# EasyEDA Pro project ProPrj_智能车驱动板2_2025-03-05.epro

# Schematic Schematic1
Board Name: Board1; Create Date: 2025-01-11; Page Name: P1; Project Name: 智能车驱动板1; Schematic Name: Schematic1; Update Date: 2025-02-16; Company: 嘉立创EDA; Page Size: A4; Version: V1.0
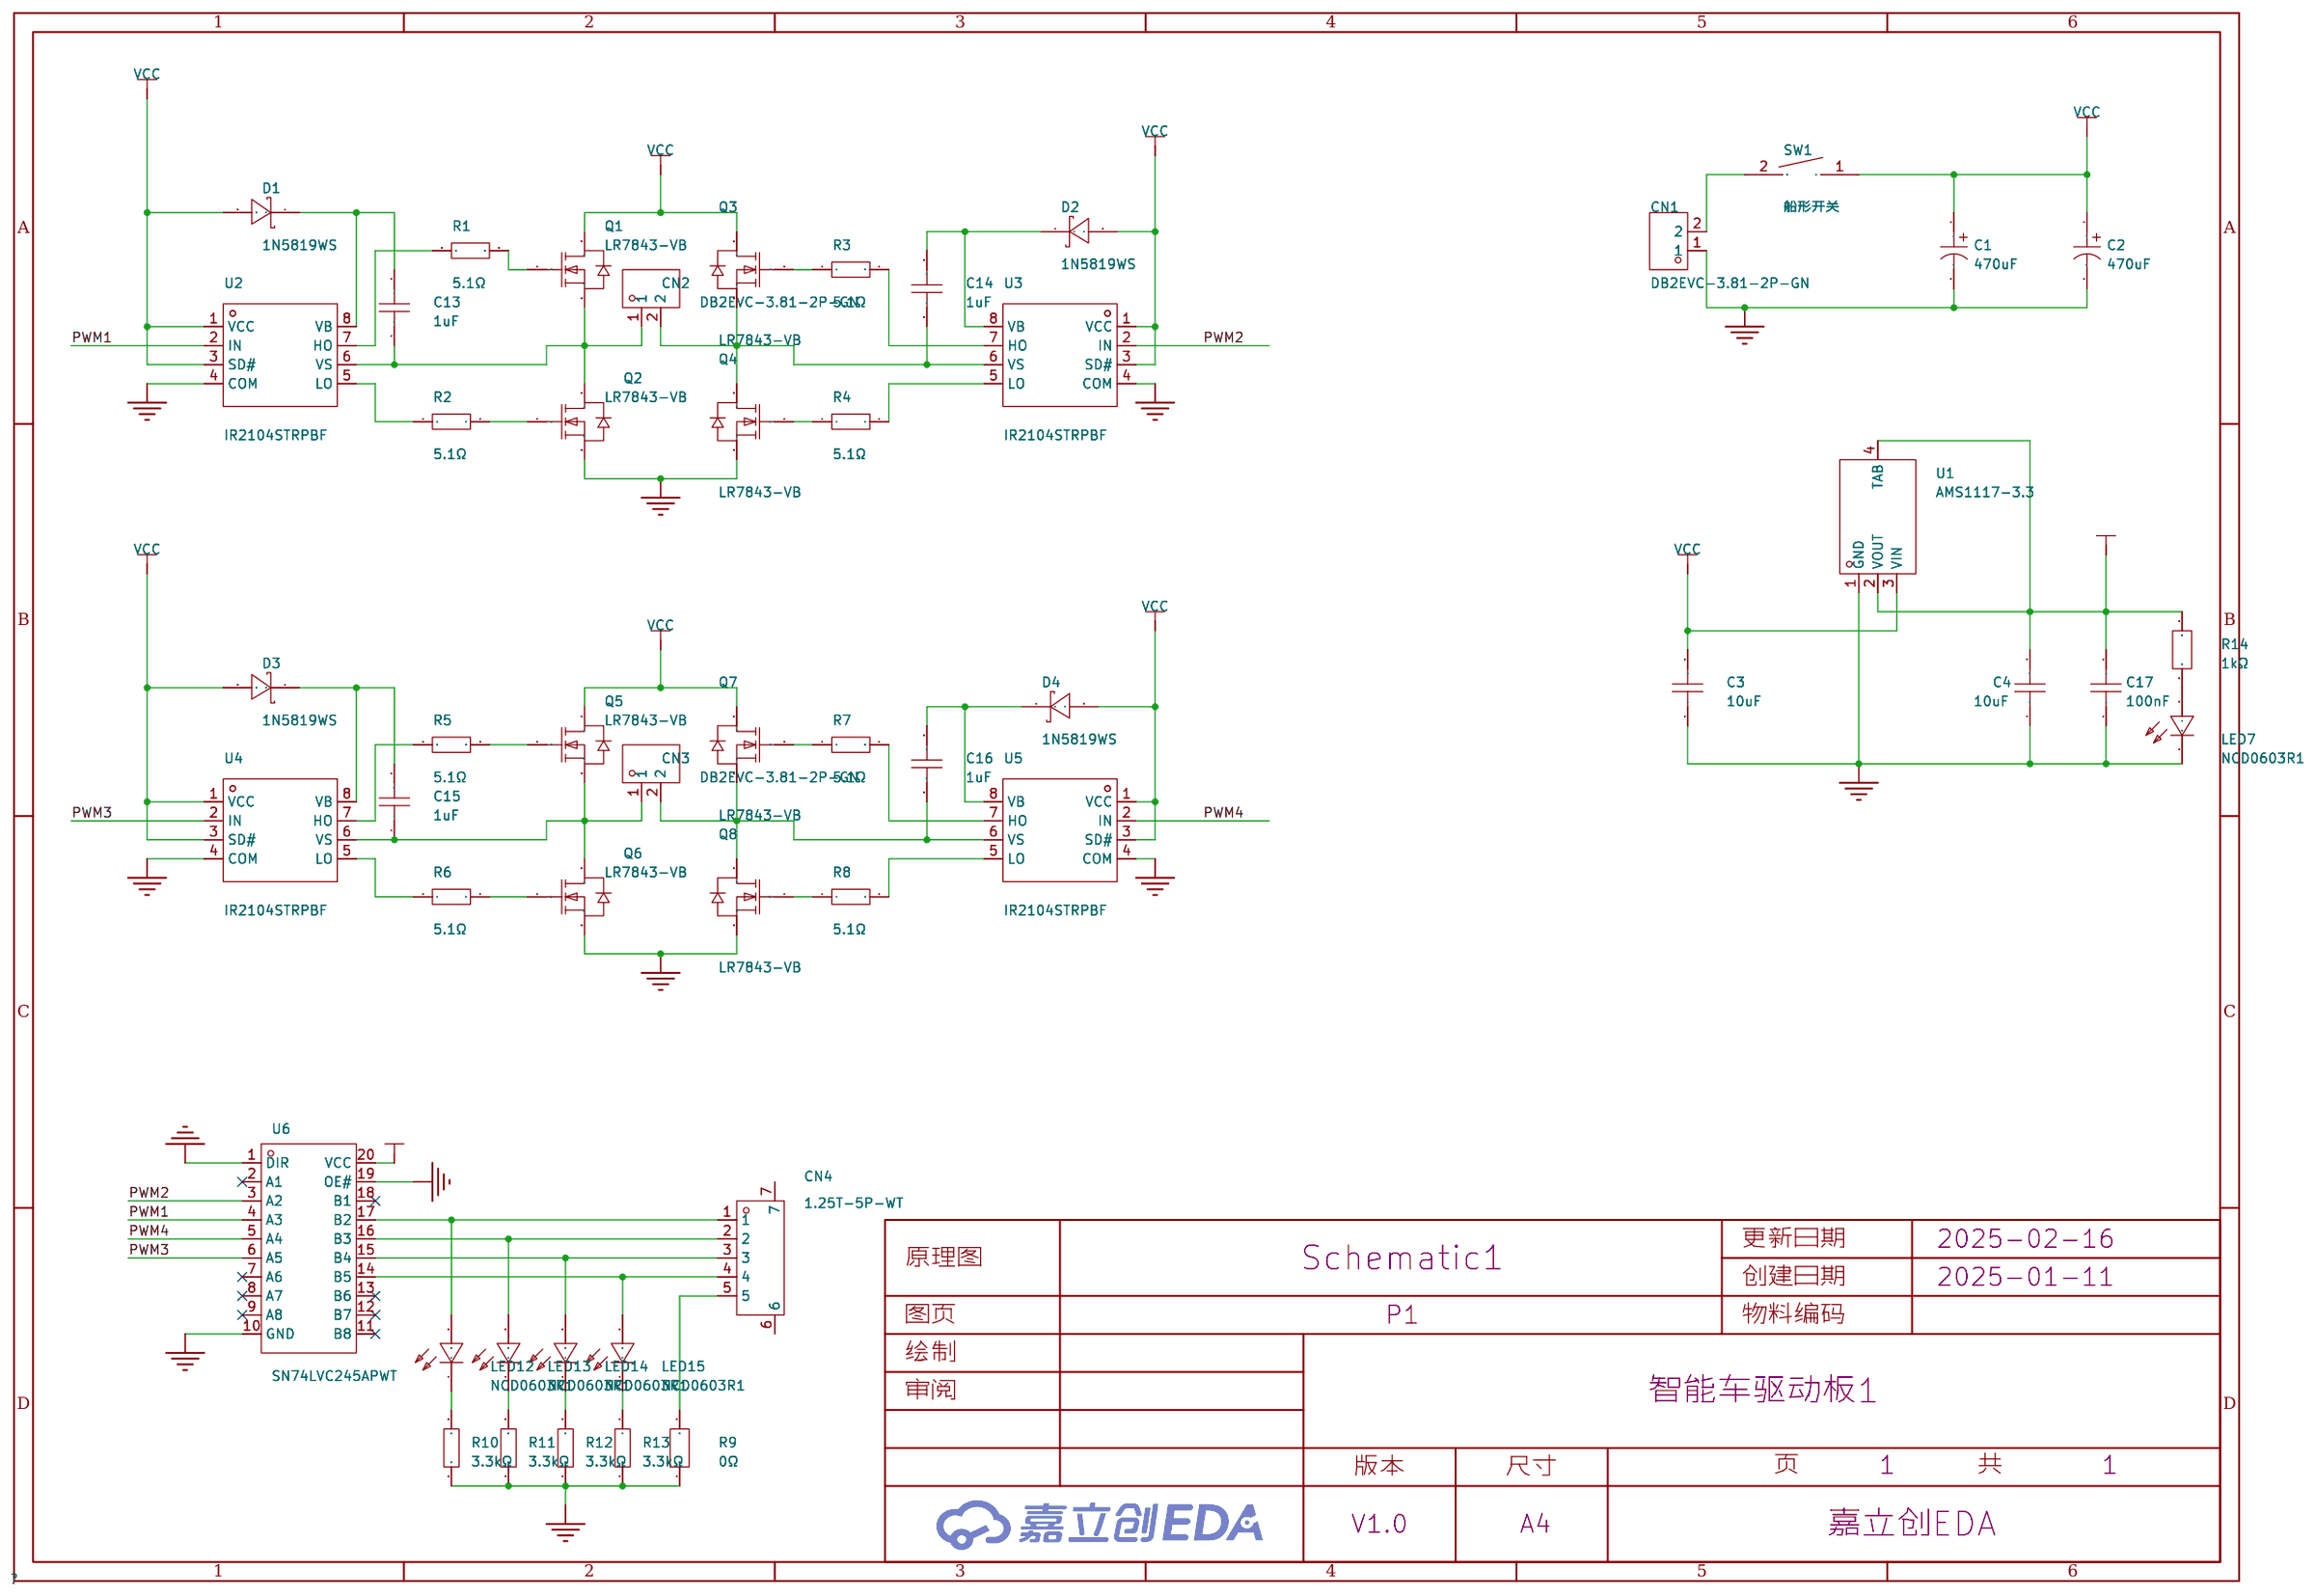
[diagram p0: schematic sheet]

## Parts
C1  470uF  [CAP-SMD_BD6.3-L6.6-W6.6-LS7.2-FD]
C2  470uF  [CAP-SMD_BD6.3-L6.6-W6.6-LS7.2-FD]
C3  10uF  [C0603]
C4  10uF  [C0603]
C13  1uF  [C0603]
C14  1uF  [C0603]
C15  1uF  [C0603]
C16  1uF  [C0603]
C17  100nF  [C0805]
CN1  DB2EVC-3.81-2P-GN  [CONN-TH_2P-P3.81_DB2EVC-3.81-2P-BK]
CN2  DB2EVC-3.81-2P-GN  [CONN-TH_2P-P3.81_DB2EVC-3.81-2P-BK]
CN3  DB2EVC-3.81-2P-GN  [CONN-TH_2P-P3.81_DB2EVC-3.81-2P-BK]
CN4  1.25T-5P-WT  [CONN-SMD_5P-P1.25_1.25T-5P-WT]
D1  1N5819WS  [SOD-323_L1.8-W1.3-LS2.5-RD]
D2  1N5819WS  [SOD-323_L1.8-W1.3-LS2.5-RD]
D3  1N5819WS  [SOD-323_L1.8-W1.3-LS2.5-RD]
D4  1N5819WS  [SOD-323_L1.8-W1.3-LS2.5-RD]
LED7  NCD0603R1  [LED0603-RD_RED]
LED12  NCD0603R1  [LED0603-RD_RED]
LED13  NCD0603R1  [LED0603-RD_RED]
LED14  NCD0603R1  [LED0603-RD_RED]
LED15  NCD0603R1  [LED0603-RD_RED]
Q1  LR7843-VB  [TO-252-2_L6.6-W6.1-P4.58-LS9.9-BR]
Q2  LR7843-VB  [TO-252-2_L6.6-W6.1-P4.58-LS9.9-BR]
Q3  LR7843-VB  [TO-252-2_L6.6-W6.1-P4.58-LS9.9-BR]
Q4  LR7843-VB  [TO-252-2_L6.6-W6.1-P4.58-LS9.9-BR]
Q5  LR7843-VB  [TO-252-2_L6.6-W6.1-P4.58-LS9.9-BR]
Q6  LR7843-VB  [TO-252-2_L6.6-W6.1-P4.58-LS9.9-BR]
Q7  LR7843-VB  [TO-252-2_L6.6-W6.1-P4.58-LS9.9-BR]
Q8  LR7843-VB  [TO-252-2_L6.6-W6.1-P4.58-LS9.9-BR]
R1  5.1Ω  [R0805]
R2  5.1Ω  [R0805]
R3  5.1Ω  [R0805]
R4  5.1Ω  [R0805]
R5  5.1Ω  [R0805]
R6  5.1Ω  [R0805]
R7  5.1Ω  [R0805]
R8  5.1Ω  [R0805]
R9  0Ω  [R0603]
R10  3.3kΩ  [R0603]
R11  3.3kΩ  [R0603]
R12  3.3kΩ  [R0603]
R13  3.3kΩ  [R0603]
R14  1kΩ  [R0603]
SW1  船形开关  [SW-TH_RS601HL-1010011BB]
U1  AMS1117-3.3  [SOT-223-3_L6.5-W3.5-P3.05-LS7.0]
U2  IR2104STRPBF  [SOIC-8_L4.9-W3.9-P1.27-LS6.0-BL]
U3  IR2104STRPBF  [SOIC-8_L4.9-W3.9-P1.27-LS6.0-BL]
U4  IR2104STRPBF  [SOIC-8_L4.9-W3.9-P1.27-LS6.0-BL]
U5  IR2104STRPBF  [SOIC-8_L4.9-W3.9-P1.27-LS6.0-BL]
U6  SN74LVC245APWT  [TSSOP-20_L6.5-W4.4-P0.65-LS6.4-BL]

## Library data of the parts
C1 C2 = PM101M025E077PTR: 容值:100uF;精度:±20%;额定电压:25V;; LCSC Part Name: 100uF ±20% 25V; Supplier Part: C2858382; Manufacturer: CapXon(丰宾); Supplier Footprint: SMD,6.3x7.7mm; JLCPCB Part Class: 扩展库; Datasheet: https://atta.szlcsc.com/upload/public/pdf/source/20210804/C2858382_57ECED37ED638FF3D71FBD68EF7F0C39.pdf; Supplier: LCSC; Tolerance: ±20%; Rated Voltage: 25V
C3 C4 = CGA0603X5R106K100JT: 容值:10uF;精度:±10%;额定电压:10V;材质(温度系数):X5R;; LCSC Part Name: 10uF ±10% 10V; Supplier Part: C6119842; Manufacturer: HRE(芯声); Supplier Footprint: 0603; JLCPCB Part Class: 扩展库; Supplier: LCSC; Tolerance: ±10%; Voltage Rated: 10V; Temperature Coefficient: X5R
C13-C16 = CGA0603X5R105K160JT: 容值:1uF;精度:±10%;额定电压:16V;材质(温度系数):X5R;; LCSC Part Name: 1uF ±10% 16V; Supplier Part: C6119849; Manufacturer: HRE(芯声); Supplier Footprint: 0603; JLCPCB Part Class: 扩展库; Supplier: LCSC; Tolerance: ±10%; Voltage Rated: 16V; Temperature Coefficient: X5R
C17 = CC0805KRX7R9BB104: 容值:100nF;精度:±10%;额定电压:50V;材质(温度系数):X7R;; LCSC Part Name: 100nF ±10% 50V; Supplier Part: C49678; Manufacturer: YAGEO(国巨); Supplier Footprint: 0805; JLCPCB Part Class: 基础库; Datasheet: https://atta.szlcsc.com/upload/public/pdf/source/20180224/C181747_15194369449651363981.pdf; Supplier: LCSC; Tolerance: ±10%; Voltage Rated: 50V; Temperature Coefficient: X7R
CN1-CN3 = DB2EVC-3.81-2P-GN: 连接器类型:板端/插座-闭口;结构:1x2P;间距:3.81mm;颜色:绿色;安装方式:直针;排数:1;每排PIN数:2;额定电流:10A;额定电压:250V;工作温度范围:-40℃~+105℃;; LCSC Part Name: 3.81mm 1x2P 排数:1 每排P数:2; Supplier Part: C395686; Manufacturer: DORABO(地博电气); Supplier Footprint: 插件,P=3.81mm; JLCPCB Part Class: 扩展库; Datasheet: https://atta.szlcsc.com/upload/public/pdf/source/20230106/E295F87ABDAA44E449E4D4A582259339.pdf; Supplier: LCSC; Connector Type: 板端/插座-闭口; Structure: 1x2P; Pitch: 3.81mm; Color: 绿色; Mounting Style: 直针; Number of Pins: 2P; Number of Rows: 1; Number of PINs Per Row: 2; Current Rating (Max): 10A; Voltage Rating (Max): 250V; Operating Temperature Range: -40℃~+105℃
CN4 = 1.25T-5P-WT: 插针结构:1x5P;间距:1.25mm;安装方式:-;参考系列:-;总PIN数:5P;排数:1;每排PIN数:5;行距:-;触头材质:磷青铜;; LCSC Part Name: 1x5P 间距:1.25mm; Supplier Part: C97378; Manufacturer: 韩国韩荣; Supplier Footprint: SMD,P=1.25mm; JLCPCB Part Class: 扩展库; Datasheet: https://atta.szlcsc.com/upload/public/pdf/source/20200721/C707315_EB981FF53C07D03444DA83DA11F0005F.pdf; Supplier: LCSC; Pins Structure: 1x5P; Pitch: 1.25mm; Number of Pins: 5P; Number of Rows: 1; Number of PINs Per Row: 5; Contact Material: 磷青铜
D1-D4 = 1N5819WS_C191023: 正向压降(Vf):600mV@1A;直流反向耐压(Vr):40V;整流电流:1A;; LCSC Part Name: 电压:40V 电流:1A; Supplier Part: C191023; Manufacturer: Hottech(合科泰); Supplier Footprint: SOD-323; JLCPCB Part Class: 基础库; Datasheet: https://atta.szlcsc.com/upload/public/pdf/source/20220428/3CB86FD8D28D653594B4E35F9D5AEFD9.pdf; Supplier: LCSC; Forward Voltage (Vf@If): 600mV@1A; Reverse Voltage (Vr): 40V; Rectified Current: 1A
LED7 LED12-LED15 = NCD0603R1_C84263: 灯头类型:-;发光颜色:红色;正向电压(VF):1.6V~2.6V;功率:65mW;正向电流:20mA;主波长:615nm~630nm;二极管配置:独立二极管;透镜颜色:无色透明透镜;色温:-;发光强度:80mcd~220mcd;发光角度:130°;载带方式:-;工作温度:-30℃~+85℃;; Supplier Part: C84263; Manufacturer: 国星光电; Supplier Footprint: 0603; JLCPCB Part Class: 扩展库; Datasheet: https://atta.szlcsc.com/upload/public/pdf/source/20200820/C84263_DABC6A75E58F576973B407FDBA283D60.pdf; Supplier: LCSC; Emitted Color: 红色; Forward Voltage (VF): 1.6V~2.6V; Power Dissipation: 65mW; Forward Current: 20mA; Dominant Wavelength: 615nm~630nm; Diode Configuration: 独立二极管; Lens Color: 无色透明透镜; Luminous Intensity: 80mcd~220mcd; Viewing Angle: 130°; Operating Temperature: -30℃~+85℃
Q1-Q8 = LR7843-VB: 类型:1个N沟道;漏源电压(Vdss):30V;连续漏极电流(Id):35.8A;导通电阻(RDS(on)@Vgs,Id):2.3mΩ@10V,38.8A;功率(Pd):3.75W;阈值电压(Vgs(th)@Id):1.5V@250uA;; LCSC Part Name: 1个N沟道 耐压:30V 电流:120A; Supplier Part: C5137375; Manufacturer: VBsemi(微碧半导体); Supplier Footprint: TO-252; JLCPCB Part Class: 扩展库; Datasheet: https://atta.szlcsc.com/upload/public/pdf/source/20240814/AEBBAF20133735F24F8E0E251780DEE5.pdf; Supplier: LCSC; Type: 1个N沟道; Drain Source Voltage (Vdss): 30V; Continuous Drain Current (Id): 35.8A; Drain Source On Resistance (RDS(on)@Vgs,Id): 2.3mΩ@10V,38.8A; Power Dissipation (Pd): 3.75W; Gate Threshold Voltage (Vgs(th)@Id): 1.5V@250uA; Total Gate Charge (Qg@Vgs): 81.5nC@10V; Input Capacitance (Ciss@Vds): 6.201nF@15V; Reverse Transfer Capacitance (Crss@Vds): 970pF@15V; Operating Temperature: -55℃~+175℃
R1-R8 = 0805W8F510KT5E: 电阻类型:厚膜电阻;阻值:5.1Ω;精度:±1%;功率:125mW;最大工作电压:150V;温度系数:±400ppm/℃;; LCSC Part Name: 5.1Ω ±1% 125mW 厚膜电阻; Supplier Part: C17724; Manufacturer: UNI-ROYAL(厚声); Supplier Footprint: 0805; JLCPCB Part Class: 基础库; Datasheet: https://atta.szlcsc.com/upload/public/pdf/source/20200306/C422600_1E6D84923E4A46A82E41ADD87F860B5C.pdf; Supplier: LCSC; Type: 厚膜电阻; Tolerance: ±1%; Power(Watts): 125mW; Overload Voltage (Max): 150V; Temperature Coefficient: ±400ppm/℃; Operating Temperature Range: -55℃~+155℃
R9 = FRC0603F0000TS: 电阻类型:厚膜电阻;阻值:0Ω;精度:±1%;功率:100mW;最大工作电压:75V;; LCSC Part Name: 0Ω ±1% 100mW 厚膜电阻; Supplier Part: C2906974; Manufacturer: FOJAN(富捷); Supplier Footprint: 0603; JLCPCB Part Class: 扩展库; Datasheet: https://atta.szlcsc.com/upload/public/pdf/source/20211221/925EC7D7225764EE0046F22065062C87.pdf; Supplier: LCSC; Type: 厚膜电阻; Tolerance: ±1%; Power(Watts): 100mW; Overload Voltage (Max): 75V; Operating Temperature Range: -55℃~+155℃
R10-R13 = 0603WAF3301T5E: 电阻类型:厚膜电阻;阻值:3.3kΩ;精度:±1%;功率:100mW;最大工作电压:75V;温度系数:±100ppm/℃;; LCSC Part Name: 3.3kΩ ±1% 100mW 厚膜电阻; Supplier Part: C22978; Manufacturer: UNI-ROYAL(厚声); Supplier Footprint: 0603; JLCPCB Part Class: 基础库; Datasheet: https://atta.szlcsc.com/upload/public/pdf/source/20200306/C422600_1E6D84923E4A46A82E41ADD87F860B5C.pdf; Supplier: LCSC; Type: 厚膜电阻; Tolerance: ±1%; Power(Watts): 100mW; Overload Voltage (Max): 75V; Temperature Coefficient: ±100ppm/℃; Operating Temperature Range: -55℃~+155℃
R14 = FCR0603F1K: 电阻类型:厚膜电阻;阻值:1kΩ;精度:±1%;功率:100mW;最大工作电压:75V;; LCSC Part Name: 1K ±1%; Supplier Part: C5913168; Manufacturer: VO(翔胜); Supplier Footprint: 0603; JLCPCB Part Class: 扩展库; Datasheet: https://atta.szlcsc.com/upload/public/pdf/source/20230428/98B65D379E9BA4CF2A9223D1647B01B6.pdf; Supplier: LCSC; Type: 厚膜电阻; Tolerance: ±1%; Power(Watts): 100mW; Overload Voltage (Max): 75V; Operating Temperature Range: -55℃~+155℃
SW1 = RS601HL-1010011BB: 带灯:无;引脚样式:焊片;额定电流:3A;额定电压(AC):250V;额定电压(DC):-;电路结构:单刀单掷;机械寿命:1万次;; Supplier Part: C2885782; Manufacturer: HCTL(华灿天禄); Supplier Footprint: 插件; JLCPCB Part Class: 扩展库; Datasheet: https://atta.szlcsc.com/upload/public/pdf/source/20210820/B1970E40D09304D7FA648AE2099FB3E8.pdf; Supplier: LCSC; Switch Length: 15mm; Switch Width: 10.5mm; Switch Height: 11.7mm; Actuator Type: 凹面弯曲; With Lamp: 无; Pin Style: 焊片; Actuator Color: 黑色; Contact Current: 3A; Voltage Rating (AC): 250V; Circuit: 单刀单掷; Mechanical Life: 1万次; Operating Temperature: -25℃~+85℃; Actuator Identifier: - O
U1 = AMS1117-3.3_C5250992: 输出类型:固定;工作电压:12V;输出电压:3.3V;输出电流:1A;电源纹波抑制比(PSRR):70dB@(120Hz);输出极性:正极;; Supplier Part: C5250992; Manufacturer: TWGMC(台湾迪嘉); Supplier Footprint: SOT-223-3L; JLCPCB Part Class: 扩展库; Datasheet: https://atta.szlcsc.com/upload/public/pdf/source/20221109/A58A92B07670E85D28928AE371260E8D.pdf; Supplier: LCSC; Output Type: 固定; Maximum Input Voltage: 12V; Output Voltage: 3.3V; Output Current: 1A; Power Supply Rejection Ratio (PSRR): 70dB@(120Hz); Operating Temperature: -40℃~+125℃@(Tj); Output Polarity: 正极; Number of Outputs: 1
U2-U5 = IR2104STRPBF: 驱动配置:半桥;负载类型:MOSFET；IGBT;驱动通道数:2;峰值灌电流:360mA;峰值拉电流:210mA;电源电压:10V~20V;上升时间:100ns;下降时间:50ns;; Supplier Part: C2960; Manufacturer: Infineon(英飞凌); Supplier Footprint: SOIC-8; JLCPCB Part Class: 扩展库; Datasheet: https://atta.szlcsc.com/upload/public/pdf/source/20140906/1457707236579.pdf; Supplier: LCSC; Driven Configuration: 半桥; Load Type: MOSFET；IGBT; Number of Drivers: 2; Peak Output Current(sink): 360mA; Peak Output Current(source): 210mA; Supply Voltage: 10V~20V; Rise Time: 100ns; Fall Time: 50ns; Operating Temperature: -40℃~+150℃@(Tj)
U6 = SN74LVC245APWT: 电源电压:1.65V~3.6V;元件数:1;每个元件位数:8;灌电流(IOL):24mA;拉电流(IOH):24mA;; Supplier Part: C2675658; Manufacturer: TI(德州仪器); Supplier Footprint: TSSOP-20; JLCPCB Part Class: 扩展库; Datasheet: https://www.ti.com/cn/lit/gpn/sn74lvc245a; Supplier: LCSC; output type: 三态; Supply Voltage: 1.65V~3.6V; Number of Elements: 1; Number of Bits per Element: 8; Sink Current: 24mA; Source Current: 24mA; Logic Family: 74LVC; Operating Temperature: -40℃~+125℃

## Nets
3V3: C4.2 C17.2 R14.2 U1.2(VOUT) U1.4(TAB) U6.20(VCC)
GND: C1.2 C2.2 C3.1 C4.1 C17.1 CN1.1 LED7.1(K) Q2.3(S) Q4.3(S) Q6.3(S) Q8.3(S) R9.1 R10.1 R11.1 R12.1 R13.1 U1.1(GND) U2.4(COM) U3.4(COM) U4.4(COM) U5.4(COM) U6.1(DIR) U6.10(GND) U6.19(OE#)
VCC: C1.1 C2.1 C3.2 D1.2(A) D2.2(A) D3.2(A) D4.2(A) Q1.2(D) Q3.2(D) Q5.2(D) Q7.2(D) SW1.1 U1.3(VIN) U2.1(VCC) U2.3(SD#) U3.1(VCC) U3.3(SD#) U4.1(VCC) U4.3(SD#) U5.1(VCC) U5.3(SD#)
PWM1: U2.2(IN) U6.4(A3)
PWM2: U3.2(IN) U6.3(A2)
PWM3: U4.2(IN) U6.6(A5)
PWM4: U5.2(IN) U6.5(A4)
$1N392: CN1.2 SW1.2
$1N1662: C13.1 CN2.1 Q1.3(S) Q2.2(D) U2.6(VS)
$1N2189: Q2.1(G) R2.2
$1N2193: Q1.1(G) R1.2
$1N2356: R1.1 U2.7(HO)
$1N2368: R2.1 U2.5(LO)
$1N2448: Q3.1(G) R3.1
$1N2452: Q4.1(G) R4.1
$1N2679: C14.2 D2.1(K) U3.8(VB)
$1N2765: C14.1 CN2.2 Q3.3(S) Q4.2(D) U3.6(VS)
$1N2773: R3.2 U3.7(HO)
$1N2816: R4.2 U3.5(LO)
$1N3504: C15.1 CN3.1 Q5.3(S) Q6.2(D) U4.6(VS)
$1N3530: Q6.1(G) R6.2
$1N3532: Q5.1(G) R5.2
$1N3541: C15.2 D3.1(K) U4.8(VB)
$1N3546: R5.1 U4.7(HO)
$1N3550: R6.1 U4.5(LO)
$1N3554: Q7.1(G) R7.1
$1N3556: Q8.1(G) R8.1
$1N3570: C16.2 D4.1(K) U5.8(VB)
$1N3576: C16.1 CN3.2 Q7.3(S) Q8.2(D) U5.6(VS)
$1N3586: R7.2 U5.7(HO)
$1N3589: R8.2 U5.5(LO)
$1N3709: C13.2 D1.1(K) U2.8(VB)
$1N6387: LED12.1(K) R10.2
$1N6392: CN4.1 LED12.2(A) U6.17(B2)
$1N6439: LED13.1(K) R11.2
$1N6444: CN4.2 LED13.2(A) U6.16(B3)
$1N6491: LED14.1(K) R12.2
$1N6496: CN4.3 LED14.2(A) U6.15(B4)
$1N6543: LED15.1(K) R13.2
$1N6548: CN4.4 LED15.2(A) U6.14(B5)
$1N6599: CN4.5 R9.2
$1N7253: LED7.2(A) R14.1

Not connected (* = marked no-connect by the designer): CN4 6 7; U6 2(A1)* 7(A6)* 8(A7)* 9(A8)* 11(B8)* 12(B7)* 13(B6)* 18(B1)*

# Board PCB1
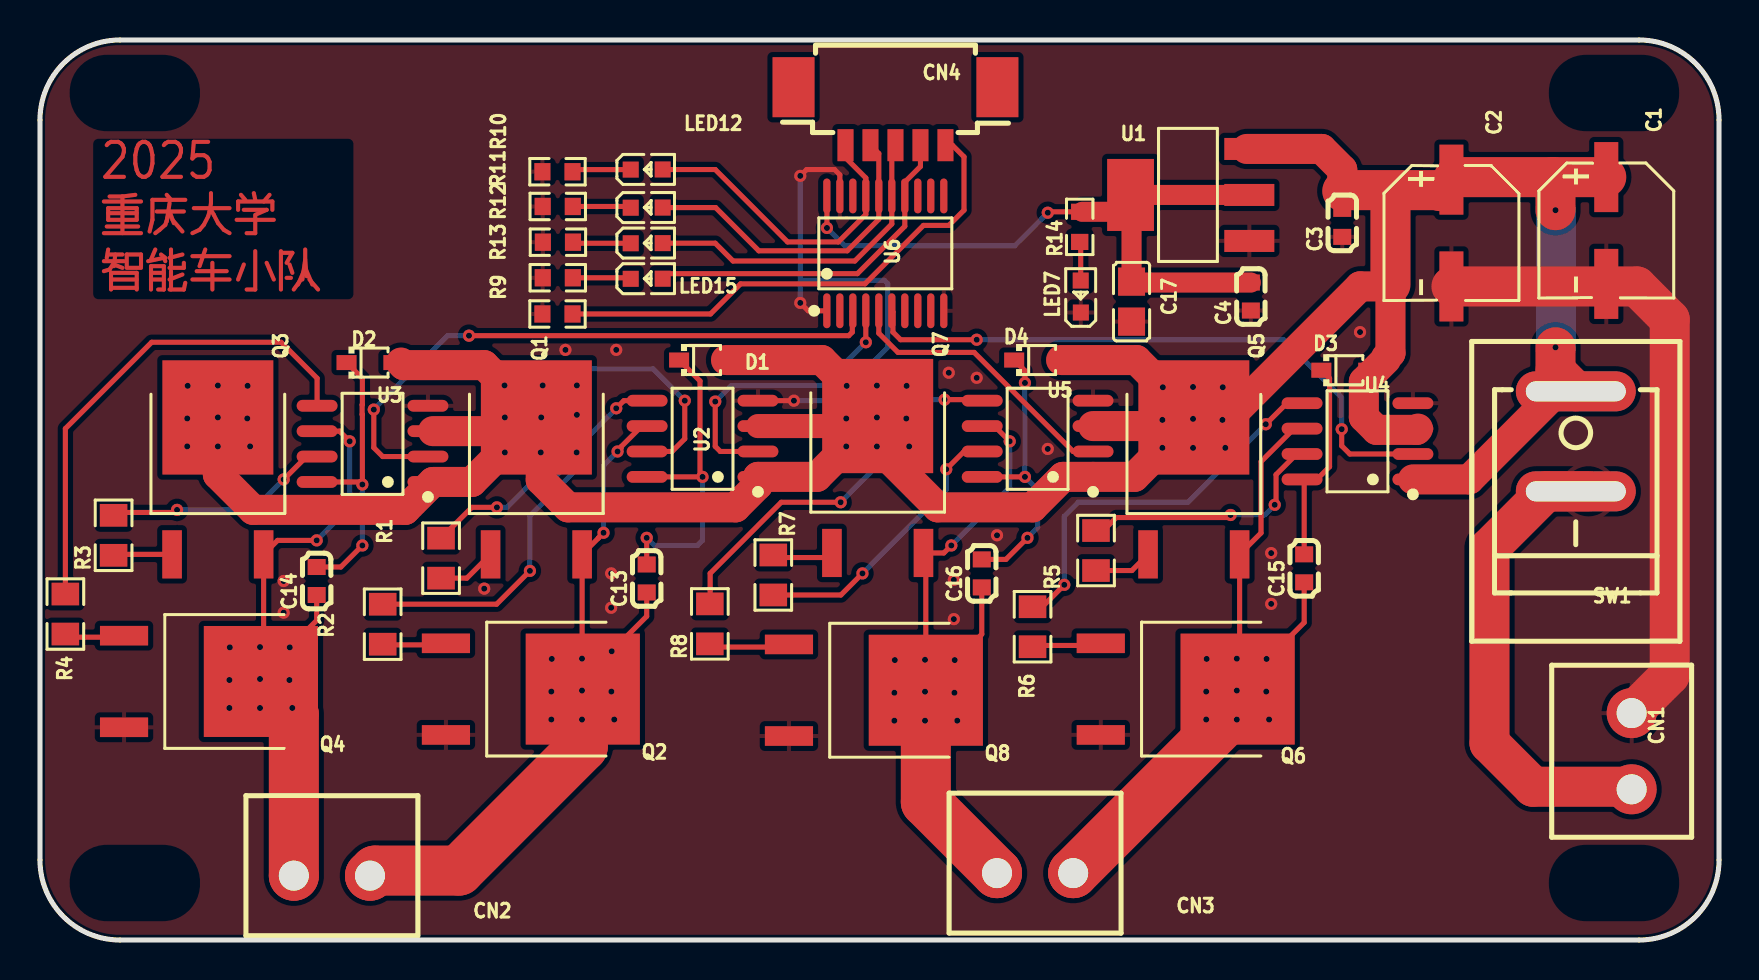
[diagram p1: board, top side]
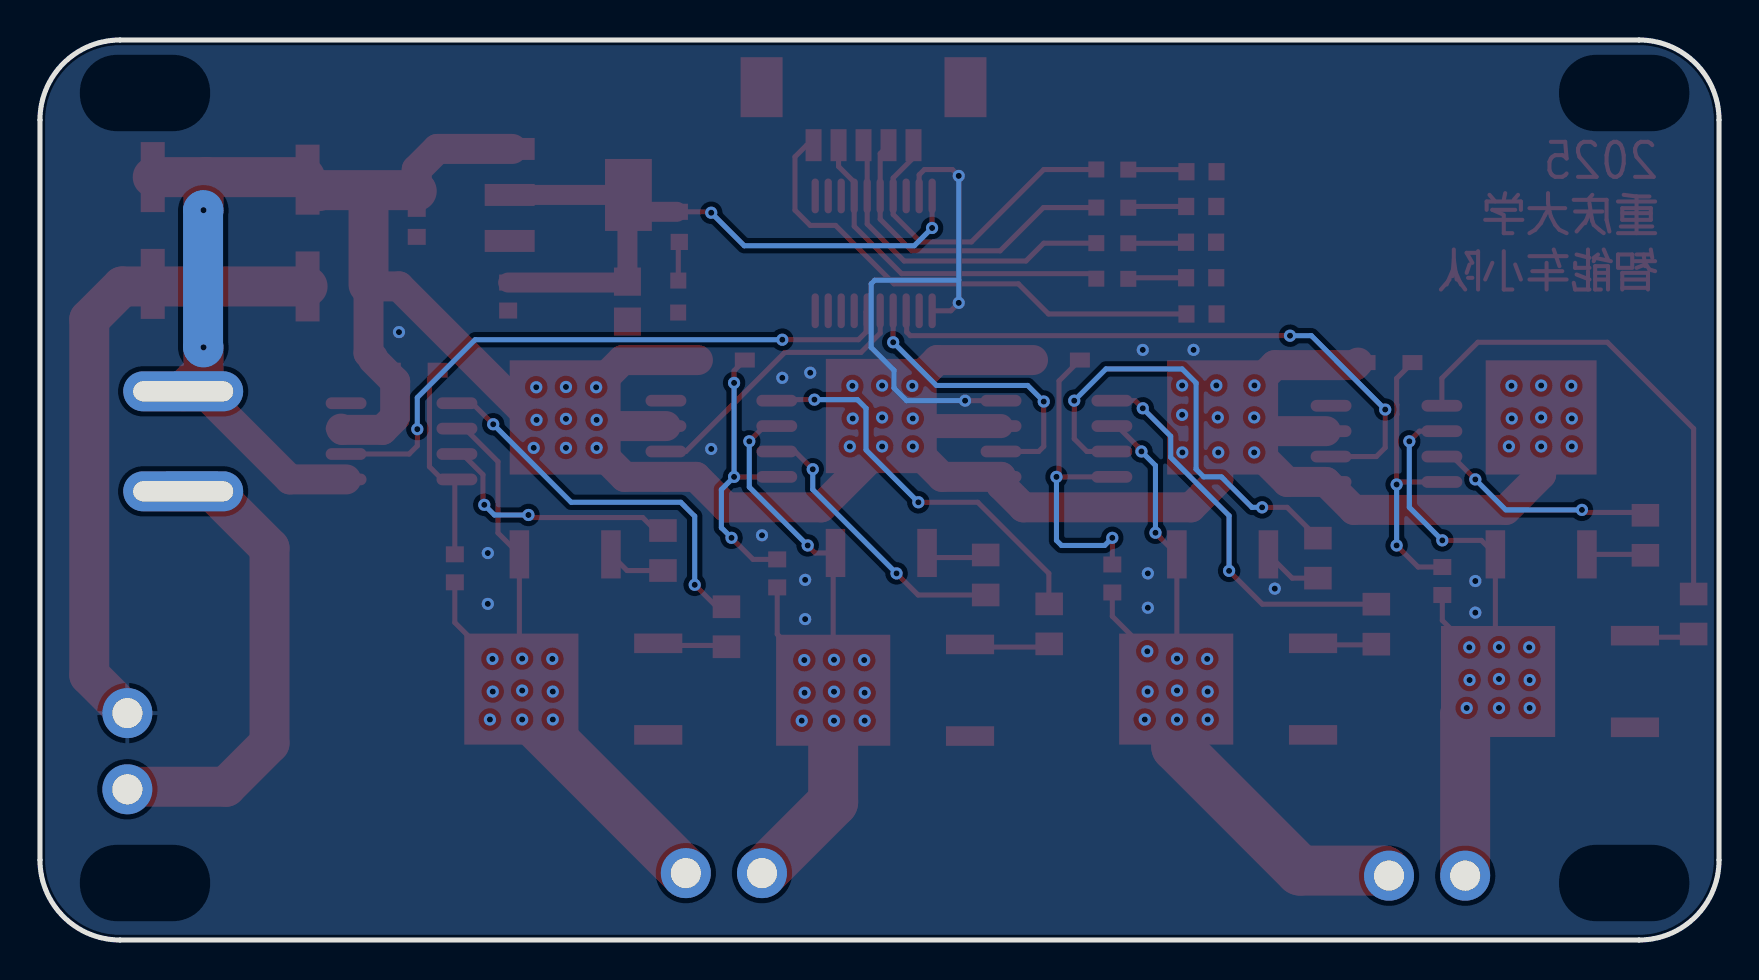
[diagram p2: board, bottom side, seen from below]

Outline 84 x 45 mm; copper layers: Top Layer, Bottom Layer. Coordinates in mm from the lower left corner of the outline.
Outline path: 0,41 0,4 arc(1.17,1.17) 4,0 80,0 arc(82.83,1.17) 84,4 84,41 arc(82.83,43.83) 80,45 4,45 arc(1.17,43.83) 0,41
Stack: Top Layer 0.035mm / Dielectric1 1.51mm FR4 er 4.5 / Bottom Layer 0.035mm

## Design rules (mm)
template: JLCPCB Capability(Two Layers Board)
spacing copperThickness1oz (default): track to track 0.102, other pairs 0.152 to 0.3
spacing copperThickness2oz: track to track 0.203, other pairs 0.152 to 0.3
track width copperThickness1oz (default): min 0.127, default 0.254, max 2.54
track width copperThickness2oz: min 0.203, default 0.254, max 2.54
differential pair differentialPair (default): width min 0.127, default 0.254, max 2.54; gap min 0.152, default 0.152
via viaSize (default): diameter min 0.5, default 0.61, max 10; hole min 0.3, default 0.305, max 6.3

## Placement (name value [footprint] x y rotation side)
C1  470uF  [CAP-SMD_BD6.3-L6.6-W6.6-LS7.2-FD]  78.36 35.47 270 top
C2  470uF  [CAP-SMD_BD6.3-L6.6-W6.6-LS7.2-FD]  70.61 35.35 270 top
C3  10uF  [C0603]  65.15 35.86 90 top
C4  10uF  [C0603]  60.58 32.17 90 top
C13  1uF  [C0603]  30.35 18.08 90 top
C14  1uF  [C0603]  13.84 17.95 90 top
C15  1uF  [C0603]  63.25 18.58 90 top
C16  1uF  [C0603]  47.12 18.33 90 top
C17  100nF  [C0805]  54.61 31.92 90 top
CN1  DB2EVC-3.81-2P-GN  [CONN-TH_2P-P3.81_DB2EVC-3.81-2P-BK]  79.63 9.44 270 top
CN2  DB2EVC-3.81-2P-GN  [CONN-TH_2P-P3.81_DB2EVC-3.81-2P-BK]  14.6 3.22 180 top
CN3  DB2EVC-3.81-2P-GN  [CONN-TH_2P-P3.81_DB2EVC-3.81-2P-BK]  49.78 3.34 180 top
CN4  1.25T-5P-WT  [CONN-SMD_5P-P1.25_1.25T-5P-WT]  42.8 41.19 180 top
D1  1N5819WS  [SOD-323_L1.8-W1.3-LS2.5-RD]  33.15 29 0 top
D2  1N5819WS  [SOD-323_L1.8-W1.3-LS2.5-RD]  16.51 28.87 0 top
D3  1N5819WS  [SOD-323_L1.8-W1.3-LS2.5-RD]  65.28 28.49 0 top
D4  1N5819WS  [SOD-323_L1.8-W1.3-LS2.5-RD]  49.91 29 0 top
LED7  NCD0603R1  [LED0603-RD_RED]  52.07 32.17 90 top
LED12  NCD0603R1  [LED0603-RD_RED]  30.35 38.52 0 top
LED13  NCD0603R1  [LED0603-RD_RED]  30.35 36.62 0 top
LED14  NCD0603R1  [LED0603-RD_RED]  30.35 34.84 0 top
LED15  NCD0603R1  [LED0603-RD_RED]  30.35 33.06 0 top
Q1  LR7843-VB  [TO-252-2_L6.6-W6.1-P4.58-LS9.9-BR]  24.83 22.7 270 top
Q2  LR7843-VB  [TO-252-2_L6.6-W6.1-P4.58-LS9.9-BR]  23.73 12.55 180 top
Q3  LR7843-VB  [TO-252-2_L6.6-W6.1-P4.58-LS9.9-BR]  8.9 22.7 270 top
Q4  LR7843-VB  [TO-252-2_L6.6-W6.1-P4.58-LS9.9-BR]  7.63 12.93 180 top
Q5  LR7843-VB  [TO-252-2_L6.6-W6.1-P4.58-LS9.9-BR]  57.73 22.7 270 top
Q6  LR7843-VB  [TO-252-2_L6.6-W6.1-P4.58-LS9.9-BR]  56.49 12.55 180 top
Q7  LR7843-VB  [TO-252-2_L6.6-W6.1-P4.58-LS9.9-BR]  41.91 22.78 270 top
Q8  LR7843-VB  [TO-252-2_L6.6-W6.1-P4.58-LS9.9-BR]  40.89 12.49 180 top
R1  5.1Ω  [R0805]  20.07 19.09 270 top
R2  5.1Ω  [R0805]  17.14 15.79 270 top
R3  5.1Ω  [R0805]  3.68 20.23 90 top
R4  5.1Ω  [R0805]  1.27 16.3 90 top
R5  5.1Ω  [R0805]  52.83 19.47 270 top
R6  5.1Ω  [R0805]  49.66 15.66 270 top
R7  5.1Ω  [R0805]  36.69 18.25 270 top
R8  5.1Ω  [R0805]  33.51 15.81 90 top
R9  0Ω  [R0603]  25.89 31.3 0 top
R10  3.3kΩ  [R0603]  25.89 38.41 0 top
R11  3.3kΩ  [R0603]  25.9 36.68 0 top
R12  3.3kΩ  [R0603]  25.91 34.89 0 top
R13  3.3kΩ  [R0603]  25.91 33.11 0 top
R14  1kΩ  [R0603]  52.02 35.66 90 top
SW1  船形开关  [SW-TH_RS601HL-1010011BB]  76.83 24.93 270 top
U1  AMS1117-3.3  [SOT-223-3_L6.5-W3.5-P3.05-LS7.0]  57.53 37.25 0 top
U2  IR2104STRPBF  [SOIC-8_L4.9-W3.9-P1.27-LS6.0-BL]  33.15 25.06 90 top
U3  IR2104STRPBF  [SOIC-8_L4.9-W3.9-P1.27-LS6.0-BL]  16.64 24.81 90 top
U4  IR2104STRPBF  [SOIC-8_L4.9-W3.9-P1.27-LS6.0-BL]  65.91 24.93 90 top
U5  IR2104STRPBF  [SOIC-8_L4.9-W3.9-P1.27-LS6.0-BL]  49.91 25.06 90 top
U6  SN74LVC245APWT  [TSSOP-20_L6.5-W4.4-P0.65-LS6.4-BL]  42.29 34.33 0 top

## Footprints (pads in the part's own frame, mm; a bottom-side part is the same pattern mirrored in y, then rotated)
C0603
  rect 0.8x0.9 smd: 1(-0.7,0) 2(0.7,0)
C0805
  rect 1.41x1.35 smd: 1(-1,0) 2(1,0)
CAP-SMD_BD6.3-L6.6-W6.6-LS7.2-FD
  rect 3.5x1.2 smd: 1(-2.67,0) 2(2.67,0)
CONN-SMD_5P-P1.25_1.25T-5P-WT
  rect 0.8x1.6 smd: 1(2.5,1.45) 2(1.25,1.45) 3(0,1.45) 4(-1.25,1.45) 5(-2.5,1.45)
  rect 2.1x3 smd: 6(-5.099,-1.45) 7(5.099,-1.45)
CONN-TH_2P-P3.81_DB2EVC-3.81-2P-BK
  round 2.5 hole 1.5: 1(-1.905,0) 2(1.905,0)
LED0603-RD_RED
  rect 0.8x0.8 smd: 1(-0.799,-0.004) 2(0.799,0.004)
R0603
  rect 0.806x0.864 smd: 1(-0.753,0) 2(0.753,0)
R0805
  rect 1.133x1.377 smd: 1(-1,0) 2(1,0)
SOD-323_L1.8-W1.3-LS2.5-RD
  rect 1x0.75 smd: 1(-1.173,0) 2(1.173,0)
SOIC-8_L4.9-W3.9-P1.27-LS6.0-BL
  oval 0.588x2.045 smd: 1(-1.905,-2.772) 2(-0.635,-2.772) 3(0.635,-2.772) 4(1.905,-2.772) 5(1.905,2.772) 6(0.635,2.772) 7(-0.635,2.772) 8(-1.905,2.772)
SOT-223-3_L6.5-W3.5-P3.05-LS7.0
  rect 2.5x1.1 smd: 1(2.97,-2.3) 2(2.97,0) 3(2.97,2.3)
  rect 2.34x3.6 smd: 4(-2.97,0)
SW-TH_RS601HL-1010011BB
  oval 2x6 hole 1x5: 1(-2.5,0) 2(2.5,0)
TO-252-2_L6.6-W6.1-P4.58-LS9.9-BR
  rect 2.409x0.979 smd: 1(3.424,-2.29) 3(3.424,2.29)
  rect 5.711x5.548 smd: 2(-3.424,0)
TSSOP-20_L6.5-W4.4-P0.65-LS6.4-BL
  oval 0.364x1.742 smd: 1(-2.925,-2.871) 2(-2.275,-2.871) 3(-1.625,-2.871) 4(-0.975,-2.871) 5(-0.325,-2.871) 6(0.325,-2.871) 7(0.975,-2.871) 8(1.625,-2.871) 9(2.275,-2.871) 10(2.925,-2.871) 11(2.925,2.871) 12(2.275,2.871) 13(1.625,2.871) 14(0.975,2.871) 15(0.325,2.871) 16(-0.325,2.871) 17(-0.975,2.871) 18(-1.625,2.871) 19(-2.275,2.871) 20(-2.925,2.871)

## Nets
As in the schematic.

Pads without a net: CN4 6 7; U6 2 7 8 9 11 12 13 18

## Via types
v1: diameter 0.61, hole 0.305, Top Layer to Bottom Layer, 128 vias

## Routing (per net, layer and track width the routed paths; a pad name or vN(x,y) marks a point on that pad's centre or on a via; arc(x,y) is an arc through that point)
3V3: length 34
  Top Layer w0.254: v1(39.37,35.6) 39.37,36.94 39.37,36.95 ; R14.2 50.55,36.41
  Top Layer w1: U1.2 U1.4 ; U1.4 53.72,36.41 52.14,36.41 ; U1.4 54.61,37.2 54.61,32.87 C4.2
  Bottom Layer w0.254: v1(50.42,36.36) 48.77,34.71 40.26,34.71 v1(39.37,35.6)
GND: length 59
  Top Layer w0.254: v1(38.04,38.21) 38.35,38.52 39.75,38.52 40.02,38.26 40.02,37.2 ; U2.4 v1(37.72,26.97) ; v1(38.04,31.86) 38.43,31.46 U6.1
  Top Layer w2: C2.2 79.89,32.68 81.53,31.03 81.53,13.25 CN1.1
  Bottom Layer w0.254: 38.04,32.99 v1(38.04,31.86) ; 38.04,32.99 42.24,32.99 42.42,32.81 42.42,29.63 41.27,28.49 41.27,27.6 40.64,26.97 v1(37.72,26.97) ; 38.04,32.99 v1(38.04,38.21)
  vias: v1(12.19,17.95) v1(12.19,16.37) v1(22.23,17.57) v1(26.29,29.51) v1(28.58,18.33) v1(28.58,16.61) v1(28.83,29.51) v1(45.47,28.36) v1(45.72,18.01) v1(45.72,16.04) v1(46.86,28.11) v1(47.88,20.23) v1(50.42,24.55) v1(61.59,19.35) v1(61.59,16.81) v1(66.04,30.39)
VCC: length 165.4
  Top Layer w0.254: 24.15,25.44 Q1.2 ; C3.2 65.15,37.44
  Top Layer w1.2: v1(40.34,26.07) 39.96,25.7 U2.3
  Top Layer w1.5: 19.66,25.44 24.15,25.44 21.61,22.9 19.66,22.9 18.27,21.5 10.67,21.5 8.9,23.27 v1(8.9,24.68) ; U4.1 71.5,23.03 75.91,27.43 SW1.1 ; D4.2 54.86,29 Q5.2 59.49,26.13 66.04,32.68 67.47,32.68 67.56,32.77 67.56,29.35 67.34,29.12 ; D1.2 39.11,29 Q7.2 38.87,23.16 U2.1 35.92,22.75 34.8,21.63 26.42,21.63 25.05,23 v1(25.05,24.38) ; 18.06,28.87 18.19,28.74 22.22,28.74 Q1.2 ; 65.15,37.44 65.15,38.52 64.12,39.55 60.37,39.55 ; v1(41.87,24.68) 44.91,21.63 49.66,21.63 51.18,23.16 U5.1 54.75,23.16 57.29,25.7 U5.3 ; 68.94,25.57 68.88,25.51 66.87,25.51 66.23,26.14 66.23,27.92 67.34,29.03
  Top Layer w2: 70.04,37.44 69.99,37.49 65.2,37.49 65.15,37.44 ; 75.69,38.14 C1.1 ; 75.69,38.14 70.74,38.14 ; 75.69,38.14 75.82,38.02 v1(75.82,36.49) ; SW1.1 75.82,28.45 v1(75.82,29.63) ; 67.56,37.13 67.56,32.77
  Bottom Layer w2: v1(75.82,36.49) 75.84,36.47 75.84,29.65 v1(75.82,29.63)
  vias: v1(7.39,27.71) v1(7.37,26.08) v1(7.37,24.68) v1(8.9,27.72) v1(8.9,26.13) v1(10.39,27.71) v1(10.37,26.08) v1(10.51,24.68) v1(23.24,27.73) v1(23.26,26.13) v1(23.26,24.38) v1(25.08,26.13) v1(25.15,27.73) v1(26.86,27.73) v1(26.86,26.26) v1(26.85,24.38) v1(40.36,27.71) v1(40.34,24.68) v1(41.87,27.72) v1(41.87,26.13) v1(43.36,27.71) v1(43.34,26.07) v1(43.48,24.68) v1(56.17,27.64) v1(56.15,26) v1(56.15,24.61) v1(57.69,27.65) v1(57.69,26.06) v1(57.69,24.61) v1(59.17,27.64) v1(59.16,26) v1(59.3,24.61)
PWM1: length 14.8
  Top Layer w0.254: v1(33.78,26.92) 33.78,24.68 34.04,24.43 U2.2 ; v1(41.32,29.89) U6.4
  Bottom Layer w0.254: v1(33.78,26.92) 34.59,27.73 39.16,27.73 v1(41.32,29.89)
PWM2: length 31.4
  Top Layer w0.254: U6.3 40.64,31.44 40.64,30.39 40.46,30.22 v1(21.46,30.22) ; v1(16.7,26.52) 16.7,24.62 17.14,24.17 U3.2
  Bottom Layer w0.254: v1(16.7,26.52) 20.39,30.22 v1(21.46,30.22)
PWM3: length 31.3
  Top Layer w0.254: v1(65.12,25.54) 65.12,24.71 65.53,24.3 68.94,24.3 ; U6.6 42.67,31.41 42.67,30.39 43.05,30.01 v1(46.86,30.01)
  Bottom Layer w0.254: v1(46.86,30.01) 62.23,30.01 65.12,27.12 v1(65.12,25.54)
PWM4: length 14.3
  Top Layer w0.254: U5.2 51.69,24.43 46.74,29.38 42.93,29.38 41.97,30.34 U6.5
$1N392: length 24
  Top Layer w2: 77.47,22.43 75.35,22.43 72.52,19.6 72.52,9.84 74.7,7.66 79.5,7.66 CN1.2
$1N1662: length 34.5
  Top Layer w0.254: Q2.2 27.12,12.58 27.12,19.28 27.94,20.1 27.94,20.11 v1(28.19,20.36) ; U2.6 30.11,25.7 29.07,24.66 29.07,24.6 v1(28.89,24.43) ; v1(28.6,14.44) 30.35,16.18 C13.1
  Top Layer w2.5: CN2.1 16.76,3.47 20.95,3.47 27.16,9.67 Q2.2
  Bottom Layer w0.254: v1(28.19,20.36) 28.19,23.72 v1(28.89,24.43)
  vias: v1(25.58,12.42) v1(25.58,11.02) v1(25.61,14.05) v1(27.12,14.07) v1(27.12,12.47) v1(27.12,11.02) v1(28.59,12.42) v1(28.73,11.02)
$1N2189: length 2.9
  Top Layer w0.254: Q2.1 20.23,14.76 17.4,14.76
$1N2193: length 3
  Top Layer w0.254: R1.2 21.35,18.09 Q1.1
$1N2356: length 22.9
  Top Layer w0.254: U2.7 31.62,24.43 32.26,25.06 v1(32.26,26.97) ; R1.1 21.61,21.63 v1(22.86,21.63)
  Bottom Layer w0.254: v1(22.86,21.63) 23.37,21.63 24.89,23.16 25.78,23.16 26.16,23.54 26.16,27.86 26.86,28.55 30.67,28.55 v1(32.26,26.97)
$1N2368: length 19.7
  Top Layer w0.254: R2.1 22.84,16.79 v1(24.51,18.46) ; U2.5 29.21,26.97 v1(28.83,26.58)
  Bottom Layer w0.254: v1(24.51,18.46) 24.51,21.22 27.43,24.14 27.43,25.19 v1(28.83,26.58)
$1N2448: length 2.9
  Top Layer w0.254: Q3.1 3.73,19.28 R3.1
$1N2452: length 3
  Top Layer w0.254: Q4.1 4.13,15.14 1.27,15.14
$1N2679: length 14.5
  Top Layer w0.254: C14.2 15.05,18.65 v1(16.13,19.73) ; U3.8 16,22.9 v1(16.13,22.78) 16.13,26.27 16.12,26.28 16.12,26.76 16.13,26.78 16.13,28.08 D2.1
  Bottom Layer w0.254: v1(16.13,19.73) v1(16.13,22.78)
$1N2765: length 30.2
  Top Layer w0.254: 15.37,25.06 14.99,25.44 U3.6 ; C14.1 13.84,15.98 v1(12.5,14.63) ; v1(13.84,19.98) 11.89,19.98 Q3.3 11.19,13.06 Q4.2
  Top Layer w2.5: CN2.2 12.7,11.28 Q4.2
  Bottom Layer w0.254: v1(13.84,19.98) 15.49,21.63 v1(15.49,24.93)
  vias: v1(9.48,13) v1(9.48,11.6) v1(9.5,14.63) v1(11.01,14.65) v1(11.01,13.05) v1(11.01,11.6) v1(12.48,13) v1(12.62,11.6)
$1N2773: length 11.2
  Top Layer w0.254: 6.73,21.38 3.83,21.38 R3.2 ; v1(12.19,23.03) 13.33,24.17 U3.7
  Bottom Layer w0.254: v1(6.86,21.5) 10.67,21.5 v1(12.19,23.03)
$1N2816: length 24.8
  Top Layer w0.254: R4.2 1.27,25.57 5.59,29.89 12.06,29.89 13.86,28.09 U3.5
$1N3504: length 33.6
  Top Layer w0.254: U4.6 62.74,25.57 61.09,23.92 61.09,20.35 Q5.3 60.02,12.64 63.25,15.87 C15.1
  Top Layer w2.5: Q6.2 59.92,11.57 CN3.1
  vias: v1(58.37,14.05) v1(58.34,12.42) v1(58.34,11.02) v1(59.88,14.07) v1(59.88,12.47) v1(59.88,11.02) v1(61.36,14.05) v1(61.35,12.42) v1(61.49,11.02)
$1N3530: length 3.2
  Top Layer w0.254: Q6.1 52.96,14.73 49.91,14.73
$1N3532: length 2.9
  Top Layer w0.254: R5.2 54.63,18.47 Q5.1
$1N3541: length 10.4
  Top Layer w0.254: C15.2 63.25,22.92 U4.8 63.88,23.03 64.52,23.66 64.52,28.08 D3.1
$1N3546: length 12.7
  Top Layer w0.254: v1(59.56,21.25) 59.44,21.12 53.85,21.12 53.2,20.47 R5.1 ; 63.14,24.3 62.87,24.3 61.84,23.27 61.84,21.83 v1(61.77,21.76)
  Bottom Layer w0.254: v1(61.77,21.76) 61.26,21.25 v1(59.56,21.25)
$1N3550: length 19.7
  Top Layer w0.254: v1(61.33,25.79) 62.38,26.84 U4.5 ; v1(51.24,17.76) 50.15,16.66 R6.1
  Bottom Layer w0.254: v1(61.33,25.79) 57.42,21.89 51.94,21.89 51.24,21.19 v1(51.24,17.76)
$1N3554: length 2.6
  Top Layer w0.254: 37.07,19.12 39.39,19.12 Q7.1
$1N3556: length 4
  Top Layer w0.254: Q8.1 37.34,14.65 33.51,14.65
$1N3570: length 14.5
  Top Layer w0.254: v1(49.28,23.16) U5.8 ; D4.1 49.28,28.46 v1(49.28,27.86) ; C16.2 48.33,19.03 v1(49.4,20.11)
  Bottom Layer w0.254: v1(49.4,20.11) 49.91,20.62 49.91,22.52 v1(49.28,23.16) v1(49.28,27.86)
$1N3576: length 33.5
  Top Layer w0.254: v1(45.59,19.73) 45.22,19.35 Q7.3 44.32,19.23 Q8.2 47.12,15.29 C16.1 ; v1(48.51,24.93) 47.75,25.7 U5.6
  Top Layer w2.5: CN3.2 44.32,6.91 Q8.2
  Bottom Layer w0.254: v1(45.59,19.73) 48.51,22.65 v1(48.51,24.93)
  vias: v1(42.77,14) v1(42.74,12.36) v1(42.74,10.97) v1(44.28,14.01) v1(44.28,12.42) v1(44.28,10.97) v1(45.76,14) v1(45.75,12.36) v1(45.89,10.97)
$1N3586: length 14
  Top Layer w0.254: U5.7 46.23,24.43 v1(45.34,23.54) ; R7.2 40.07,17.25 v1(41.15,18.33)
  Bottom Layer w0.254: v1(45.34,23.54) 45.34,22.52 v1(41.15,18.33)
$1N3589: length 20
  Top Layer w0.254: R8.2 33.53,16.82 33.53,18.33 37.08,21.89 v1(40.06,21.89) ; U5.5 47.09,27.02 v1(45.26,27.02)
  Bottom Layer w0.254: v1(45.26,27.02) 43.11,27.02 42.67,26.58 42.67,24.5 v1(40.06,21.89)
$1N3709: length 16.7
  Top Layer w0.254: C13.2 v1(30.35,20.11) ; U2.8 v1(33.15,23.16) 33.02,23.28 33.02,27.95 D1.1
  Bottom Layer w0.254: v1(30.35,20.11) 30.73,19.73 32.89,19.73 33.15,19.98 v1(33.15,23.16)
$1N6387: length 3
  Top Layer w0.254: R10.2 26.75,38.52 LED12.1
$1N6392: length 16.1
  Top Layer w0.254: CN4.1 40.3,39.12 41.32,38.1 41.32,36.28 39.94,34.9 37.4,34.9 33.78,38.52 31.16,38.52 LED12.2
$1N6439: length 2.9
  Top Layer w0.254: R11.2 29.49,36.68 LED13.1
$1N6444: length 16.2
  Top Layer w0.254: CN4.2 41.97,39.32 41.97,36.04 40.39,34.46 35.96,34.46 33.8,36.62 LED13.2
$1N6491: length 2.9
  Top Layer w0.254: LED14.1 26.72,34.84 R12.2
$1N6496: length 16.6
  Top Layer w0.254: LED14.2 31.16,34.84 33.78,34.84 34.67,33.95 40.77,33.95 42.62,35.8 42.62,39.56 CN4.3
$1N6543: length 2.9
  Top Layer w0.254: LED15.1 29.5,33.11 26.66,33.11
$1N6548: length 17.6
  Top Layer w0.254: CN4.4 44.05,38.68 43.27,37.89 43.27,35.69 40.89,33.32 31.4,33.32 LED15.2
$1N6599: length 25.6
  Top Layer w0.254: R9.2 33.55,31.3 35.05,32.81 41.27,32.81 44.2,35.73 45.47,35.73 46.23,36.49 46.23,39.16 45.65,39.74 CN4.5
$1N7253: length 2
  Top Layer w0.254: LED7.2 52.07,34.85 52.02,34.9

## Copper pours and planes (outline as drawn; the poured copper is in the pictures)
GND on Top Layer: -6.48,51.98 90.3,51.98 90.3,-4.15 -6.48,-4.15
GND on Top Layer: 96.01,70.78 191.9,70.78 191.9,14.27 96.01,14.27
GND on Bottom Layer: -6.48,51.98 90.42,51.98 90.42,-3.9 -6.48,-3.9
GND on Bottom Layer: 49.78,-63.59 143,-63.59 143,-119.47 49.78,-119.47
GND on Bottom Layer: -104.52,71.03 -14.1,71.03 -14.1,21.76 -104.52,21.76

## Text on the board
Top Layer: 2025 / 重庆大学 / 智能车小队
